# Altium schematic sheet MIPI_CSI.SchDoc
size 420 x 297 mm; SheetNumber: 33; SheetTotal: 34
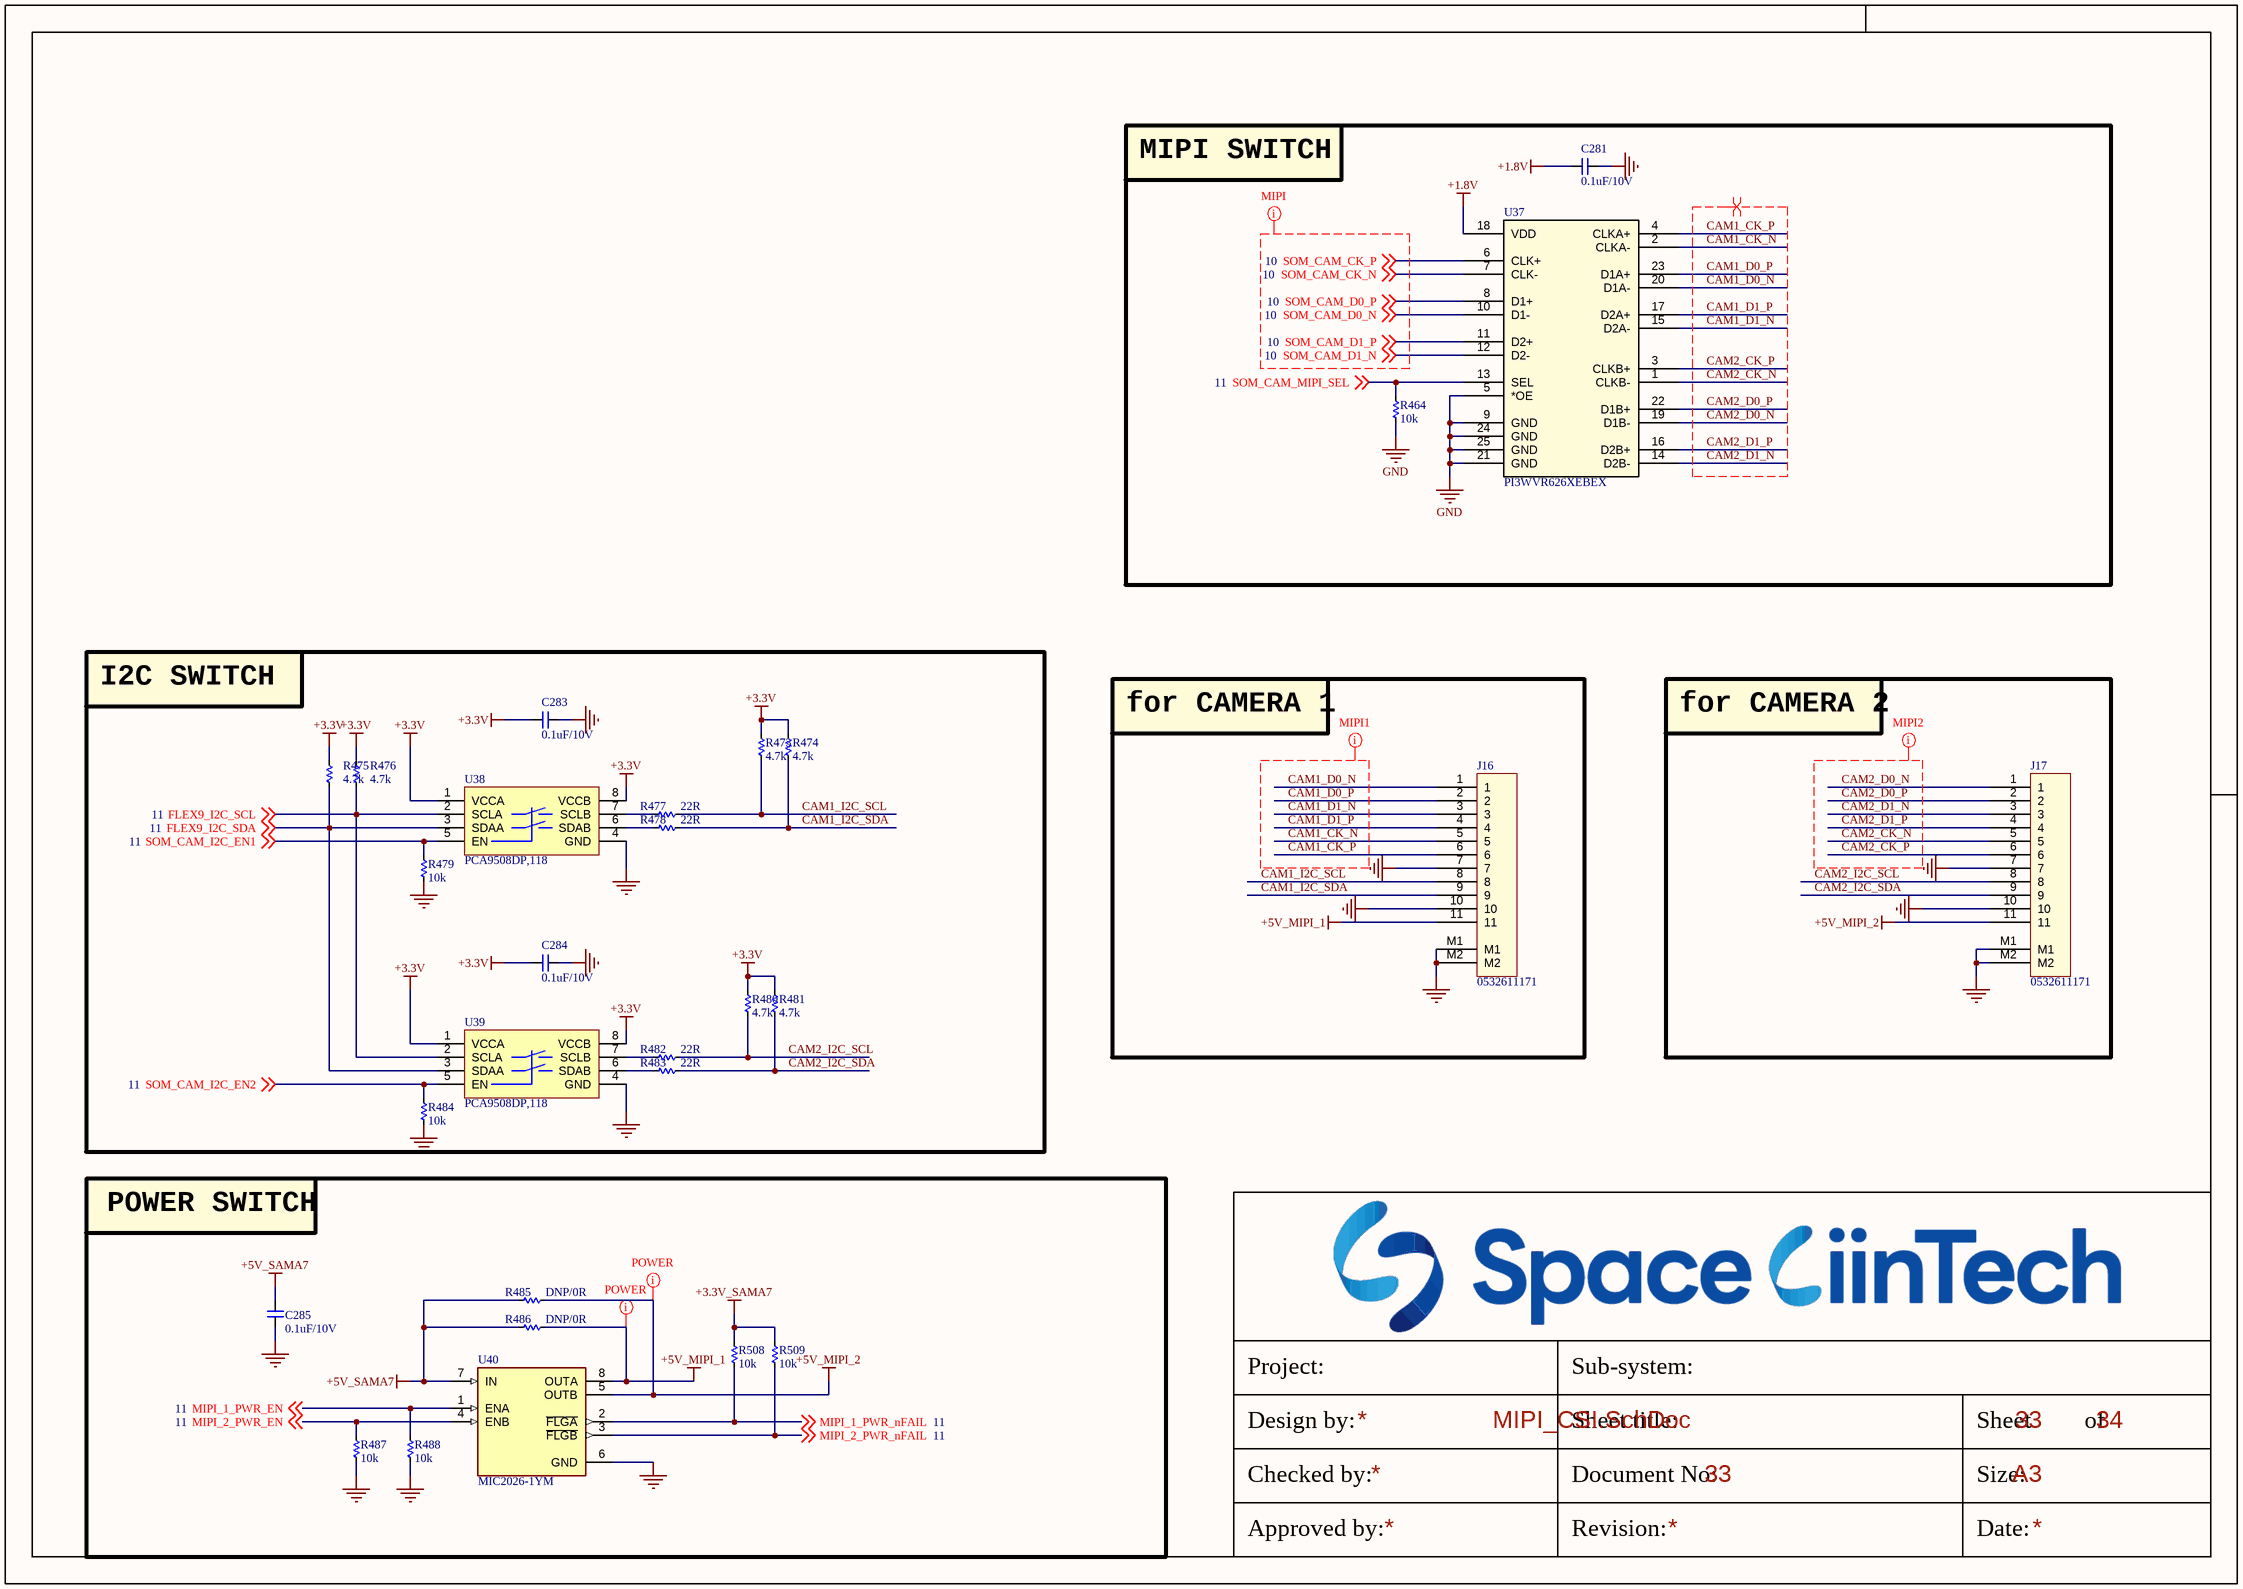
[diagram p0: MIPI_CSI.SchDoc]

## Parts
C281  0.1uF/10V  [CAP_C_1005X50_L]
C283  0.1uF/10V  [CAP_C_1005X50_L]
C284  0.1uF/10V  [CAP_C_1005X50_L]
C285  0.1uF/10V  [CAP_C_1005X50_L]
J16  0532611171  [MOLEX_0532611171]
J17  0532611171  [MOLEX_0532611171]
R464  10k  [RES_C_1005X40]
R473  4.7k  [RES_C_1005X40]
R474  4.7k  [RES_C_1005X40]
R475  4.7k  [RES_C_1005X40]
R476  4.7k  [RES_C_1005X40]
R477  22R  [RES_C_1005X40]
R478  22R  [RES_C_1005X40]
R479  10k  [RES_C_1005X40]
R480  4.7k  [RES_C_1005X40]
R481  4.7k  [RES_C_1005X40]
R482  22R  [RES_C_1005X40]
R483  22R  [RES_C_1005X40]
R484  10k  [RES_C_1005X40]
R485  DNP/0R  [RES_C_1005X40]
R486  DNP/0R  [RES_C_1005X40]
R487  10k  [RES_C_1005X40]
R488  10k  [RES_C_1005X40]
R508  10k  [RES_C_1005X40]
R509  10k  [RES_C_1005X40]
U37  PI3WVR626XEBEX  [PI3WVR626XEBEX_DIO]
U38  PCA9508DP,118  [TSOP8]
U39  PCA9508DP,118  [TSOP8]
U40  MIC2026-1YM  [SOIC127P602X173-8N]

## Blocks framed on the sheet
MIPI SWITCH: C281 R464 U37
I2C SWITCH: C283 C284 R473-R484 U38 U39
for CAMERA 1: J16
for CAMERA 2: J17
POWER SWITCH: C285 R485-R488 R508 R509 U40

## Nets
+1.8V: C281.2 U37.18(VDD)
+3.3V: C283.2 C284.2 R473.1 R474.1 R475.1 R476.1 R480.1 R481.1 U38.1(VCCA) U38.8(VCCB) U39.1(VCCA) U39.8(VCCB)
+3.3V_SAMA7: R508.1 R509.1
+5V_MIPI_1: J16.11 R486.1 U40.8(OUTA)
+5V_MIPI_2: J17.11 R485.1 U40.5(OUTB)
+5V_SAMA7: C285.2 R485.2 R486.2 U40.7(IN)
GND: C281.1 C283.1 C284.1 C285.1 J16.7 J16.10 J16.M1 J16.M2 J17.7 J17.10 J17.M1 J17.M2 R464.1 R479.2 R484.2 R487.2 R488.2 U37.5(*OE) U37.9(GND) U37.21(GND) U37.24(GND) U37.25(GND) U38.4(GND) U39.4(GND) U40.6(GND)
CAM1_CK_N: J16.5 U37.2(CLKA-)
CAM1_CK_P: J16.6 U37.4(CLKA+)
CAM1_D0_N: J16.1 U37.20(D1A-)
CAM1_D0_P: J16.2 U37.23(D1A+)
CAM1_D1_N: J16.3 U37.15(D2A-)
CAM1_D1_P: J16.4 U37.17(D2A+)
CAM1_I2C_SCL: J16.8 R473.2 R477.2
CAM1_I2C_SDA: J16.9 R474.2 R478.2
CAM2_CK_N: J17.5 U37.1(CLKB-)
CAM2_CK_P: J17.6 U37.3(CLKB+)
CAM2_D0_N: J17.1 U37.19(D1B-)
CAM2_D0_P: J17.2 U37.22(D1B+)
CAM2_D1_N: J17.3 U37.14(D2B-)
CAM2_D1_P: J17.4 U37.16(D2B+)
CAM2_I2C_SCL: J17.8 R480.2 R482.2
CAM2_I2C_SDA: J17.9 R481.2 R483.2
FLEX9_I2C_SCL: R476.2 U38.2(SCLA) U39.2(SCLA) ; off-sheet FLEX9_I2C_SCL
FLEX9_I2C_SDA: R475.2 U38.3(SDAA) U39.3(SDAA) ; off-sheet FLEX9_I2C_SDA
MIPI_1_PWR_EN: R488.1 U40.1(ENA) ; off-sheet MIPI_1_PWR_EN
MIPI_1_PWR_nFAIL: R508.2 U40.2(~{FLGA}) ; off-sheet MIPI_1_PWR_nFAIL
MIPI_2_PWR_EN: R487.1 U40.4(ENB) ; off-sheet MIPI_2_PWR_EN
MIPI_2_PWR_nFAIL: R509.2 U40.3(~{FLGB}) ; off-sheet MIPI_2_PWR_nFAIL
SOM_CAM_CK_N: U37.7(CLK-) ; off-sheet SOM_CAM_CK_N
SOM_CAM_CK_P: U37.6(CLK+) ; off-sheet SOM_CAM_CK_P
SOM_CAM_D0_N: U37.10(D1-) ; off-sheet SOM_CAM_D0_N
SOM_CAM_D0_P: U37.8(D1+) ; off-sheet SOM_CAM_D0_P
SOM_CAM_D1_N: U37.12(D2-) ; off-sheet SOM_CAM_D1_N
SOM_CAM_D1_P: U37.11(D2+) ; off-sheet SOM_CAM_D1_P
SOM_CAM_I2C_EN1: R479.1 U38.5(EN) ; off-sheet SOM_CAM_I2C_EN1
SOM_CAM_I2C_EN2: R484.1 U39.5(EN) ; off-sheet SOM_CAM_I2C_EN2
SOM_CAM_MIPI_SEL: R464.2 U37.13(SEL) ; off-sheet SOM_CAM_MIPI_SEL
NetR477_1: R477.1 U38.7(SCLB)
NetR478_1: R478.1 U38.6(SDAB)
NetR482_1: R482.1 U39.7(SCLB)
NetR483_1: R483.1 U39.6(SDAB)

## Layout directives
differential pair; net class DIFF100; differential pair class DIFF100: CAM1_CK_N, CAM1_CK_P, CAM1_D0_N, CAM1_D0_P, CAM1_D1_N, CAM1_D1_P, CAM2_CK_N, CAM2_CK_P, CAM2_D0_N, CAM2_D0_P, CAM2_D1_N, CAM2_D1_P
net class POWER: +5V_MIPI_1, +5V_MIPI_2
net class MIPI: SOM_CAM_CK_N, SOM_CAM_CK_P, SOM_CAM_D0_N, SOM_CAM_D0_P, SOM_CAM_D1_N, SOM_CAM_D1_P
net class MIPI1: CAM1_CK_N, CAM1_CK_P, CAM1_D0_N, CAM1_D0_P, CAM1_D1_N, CAM1_D1_P
net class MIPI2: CAM2_CK_N, CAM2_CK_P, CAM2_D0_N, CAM2_D0_P, CAM2_D1_N, CAM2_D1_P

## Notes on the sheet
- Project:
- Sub-system:
- Design by:
- Sheet title:
- Sheet
- of
- Checked by:
- Approved by:
- Revision:
- Document No:
- Size:
- Date:
- A3

## Library data of the parts
C281 C283 C284 = _CAP_C_2: CAP CHIP
C285 = _CAP_C_2: CAP
J16 J17 = Header 11x1_2M
R464 R473-R488 R508 R509 = _RES_B_2: RES
U37 = PI3WVR626XEBEX: Mfr_Name: Diodes Inc; RefDes: RefDes; Type: Type
U40 = IC_PWRSW_MIC2026-1YM: Power Switch/Driver 1:2 N-Channel 1.25A 8-SOIC; MF: Microchip; SnapEDA_Link: https://www.snapeda.com/parts/MIC2026-1YM/Microchip/view-part/?ref=snap; Package: SO-8 Microchip; Value: *; MP: MIC2026-1YM; Check_prices: https://www.snapeda.com/parts/MIC2026-1YM/Microchip/view-part/?ref=eda